# Altium schematic sheet RF.SchDoc: Radio Frequency Module
size A4; SheetNumber: 3; SheetTotal: 10; Project: WSN Z1; Comments: RF Module; CurrentDate: 25/02/2008
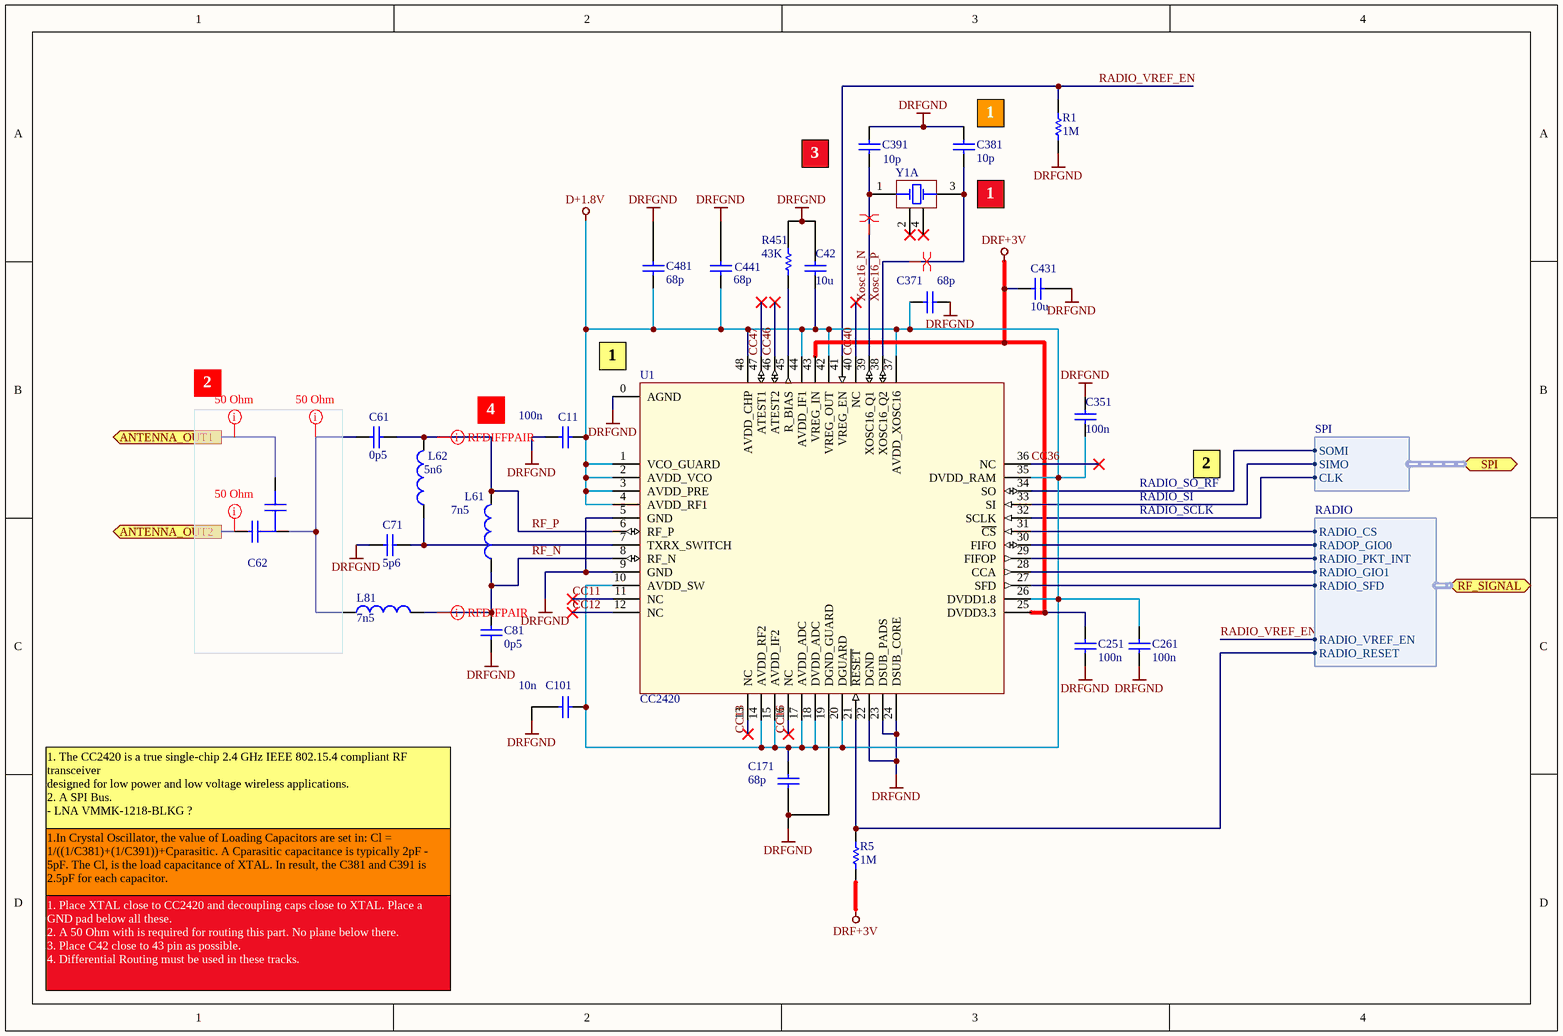
[diagram p0: RF.SchDoc]

## Parts
C11  value 100n  [CC-0402-AL]  (hidden comment: Cap Semi)
C42  value 10u  [CC2013-0805]  (hidden comment: Cap Semi)
C61  value 0p5  [CC-0402-AL]  (hidden comment: Cap Semi)
C62  Bilateral Switch Capacitor  [Dual Capacitor Switch]  (value not drawn)
C71  value 5p6  [CC-0402-AL]  (hidden comment: Cap Semi)
C81  value 0p5  [CC-0402-AL]  (hidden comment: Cap Semi)
C101  value 10n  [CC-0402-AL]  (hidden comment: Cap Semi)
C171  value 68p  [CC-0402-AL]  (hidden comment: Cap Semi)
C251  value 100n  [CC-0402-AL]  (hidden comment: Cap Semi)
C261  value 100n  [CC-0402-AL]  (hidden comment: Cap Semi)
C351  value 100n  [CC-0402-AL]  (hidden comment: Cap Semi)
C371  value 68p  [CC-0402-AL]  (hidden comment: Cap Semi)
C381  value 10p  [CC-0402-AL]  (hidden comment: Cap Semi)
C391  value 10p  [CC-0402-AL]  (hidden comment: Cap Semi)
C431  value 10u  [CC2013-0805]  (hidden comment: Cap Semi)
C441  value 68p  [CC-0402-AL]  (hidden comment: Cap Semi)
C481  value 68p  [CC-0402-AL]  (hidden comment: Cap Semi)
L61  value 7n5  [INDC1005-0402-ALT]  (hidden comment: Inductor)
L62  value 5n6  [INDC1005-0402]  (hidden comment: Inductor)
L81  value 7n5  [INDC1005-0402]  (hidden comment: Inductor)
R1  value 1M  [CR-0402-AL]  (hidden comment: Res Semi)
R5  value 1M  [CR-0402-AL]  (hidden comment: Res Semi)
R451  value 43K  [CR-0402-AL]  (hidden comment: Res Semi)
U1  CC2420  [QFN7X7-48]
Y1  XTAL 4pins  [NX3225SA- 16.000000Hhz-B3]  (value not drawn)  (part A of 2)

## Ports
ANTENNA_OUT1 (out), ANTENNA_OUT2 (out), RF_SIGNAL (harness RADIO), SPI (harness SPI)

## Harnesses
SPI: CLK, SOMI, SIMO
RADIO: RADIO_RESET, RADIO_VREF_EN, RADIO_SFD, RADIO_PKT_INT, RADOP_GIO0, RADIO_GIO1, RADIO_CS

## Nets
D+1.8V: C11.2 C42.1 C101.2 C171.1 C261.1 C351.1 C371.1 C441.1 C481.1 U1.1(VCO_GUARD) U1.2(AVDD_VCO) U1.3(AVDD_PRE) U1.4(AVDD_RF1) U1.10(AVDD_SW) U1.14(AVDD_RF2) U1.15(AVDD_IF2) U1.17(AVDD_ADC) U1.18(DVDD_ADC) U1.20(DGUARD) U1.26(DVDD1.8) U1.35(DVDD_RAM) U1.37(AVDD_XOSC16) U1.42(VREG_OUT) U1.44(AVDD_IF1) U1.48(AVDD_CHP)
DRF+3V: C251.1 C431.2 R5.1 U1.25(DVDD3.3) U1.43(VREG_IN)
DRFGND: C11.1 C42.2 C71.2 C81.1 C101.1 C171.2 C251.2 C261.2 C351.2 C371.2 C381.2 C391.2 C431.1 C441.2 C481.2 R1.1 R451.2 U1.0(AGND) U1.5(GND) U1.9(GND) U1.19(DGND_GUARD) U1.22(DGND) U1.23(DSUB_PADS) U1.24(DSUB_CORE)
ANTENNA_OUT1: C62.3 ; port ANTENNA_OUT1
ANTENNA_OUT2: C62.2 ; port ANTENNA_OUT2
CC11: U1.11(NC)
CC12: U1.12(NC)
CC13: U1.13(NC)
CC16: U1.16(NC)
CC36: U1.36(NC)
CC40: U1.40(NC)
CC46: U1.46(ATEST2)
CC47: U1.47(ATEST1)
RADIO_VREF_EN: R1.2 U1.41(VREG_EN) ; port RF_SIGNAL.RADIO_VREF_EN
RF_N: C81.2 L61.1 L81.2 U1.8(RF_N)
RF_P: C61.1 L61.2 L62.2 U1.6(RF_P)
Xosc16_N: C391.1 U1.39(XOSC16_Q1) Y1.1(OSC1)
Xosc16_P: C381.1 U1.38(XOSC16_Q2) Y1.3(OSC2)
NetC61_2: C61.2 C62.1 L81.1
NetC71_1: C71.1 L62.1 U1.7(TXRX_SWITCH)
NetR5_2: R5.2 U1.21(~{RESET}) ; port RF_SIGNAL.RADIO_RESET
NetR451_1: R451.1 U1.45(R_BIAS)
NetU1_27: U1.27(SFD) ; port RF_SIGNAL.RADIO_SFD
NetU1_28: U1.28(CCA) ; port RF_SIGNAL.RADIO_GIO1
NetU1_29: U1.29(FIFOP) ; port RF_SIGNAL.RADIO_PKT_INT
NetU1_30: U1.30(FIFO) ; port RF_SIGNAL.RADOP_GIO0
NetU1_31: U1.31(~{CS}) ; port RF_SIGNAL.RADIO_CS
NetU1_32: U1.32(SCLK) ; port SPI.CLK
NetU1_33: U1.33(SI) ; port SPI.SIMO
NetU1_34: U1.34(SO) ; port SPI.SOMI

Not connected (* = marked no-connect by the designer): Y1 2(GND)* 4(GND)*

## Layout directives
differential pair; rule Differential Pairs Routing [Pref Gap = 0.254mm    Min Gap  = 0.15mm    Max Gap  = 0.5mm]: RF_N, RF_P, Xosc16_N, Xosc16_P
rule Width Constraint [Pref Width = 0.254mm    Min Width = 0.01mm    Max Width = 3mm]: ANTENNA_OUT1, ANTENNA_OUT2, NetC61_2

## Notes on the sheet
- (near C391) 3
- (near C381) 1
- 1
- (near U1) 1
- 2
- 4
- RADIO_SCLK
- RADIO_SI
- RADIO_SO_RF
- 1. The CC2420 is a true single-chip 2.4 GHz IEEE 802.15.4 compliant RF transceiver
  designed for low power and low voltage wireless applications.
  2. A SPI Bus.
  - LNA VMMK-1218-BLKG ?
- 1.In Crystal Oscillator, the value of Loading Capacitors are set in: Cl = 1/((1/C381)+(1/C391))+Cparasitic. A Cparasitic capacitance is typically 2pF - 5pF. The Cl, is the load capacitance of XTAL. In result, the C381 and C391 is 2.5pF for each capacitor.
- 1. Place XTAL close to CC2420 and decoupling caps close to XTAL. Place a GND pad below all these.
  2. A 50 Ohm with is required for routing this part. No plane below there.
  3. Place C42 close to 43 pin as possible.
  4. Differential Routing must be used in these tracks.

## Library data of the parts
C11 C42 C61 C71 C81 C101 C171 C251 C261 C351 C371 C381 C391 C431 C441 C481 = Cap Semi: Capacitor (Semiconductor SIM Model)
C62 = Bilateral Switch Capacitor: Value: 5p6
R1 R5 = Res Semi: Semiconductor Resistor; Manufacturer: Generic Components
R451 = Res Semi: RES 43.0K OHM 1/16W 1% 0402 SMD; Manufacturer: Generic Components
U1 = CC2420: 2.4 GHz IEEE 802.15.4 / ZigBee-ready RF Transceiver
Y1 = XTAL 4pins: XTAL 7.2pF Load Capacitance.; Manufacturer: Generic Components; Value: 16Mhz